# EAGLE design v2_board (EAGLE 9.1.0)
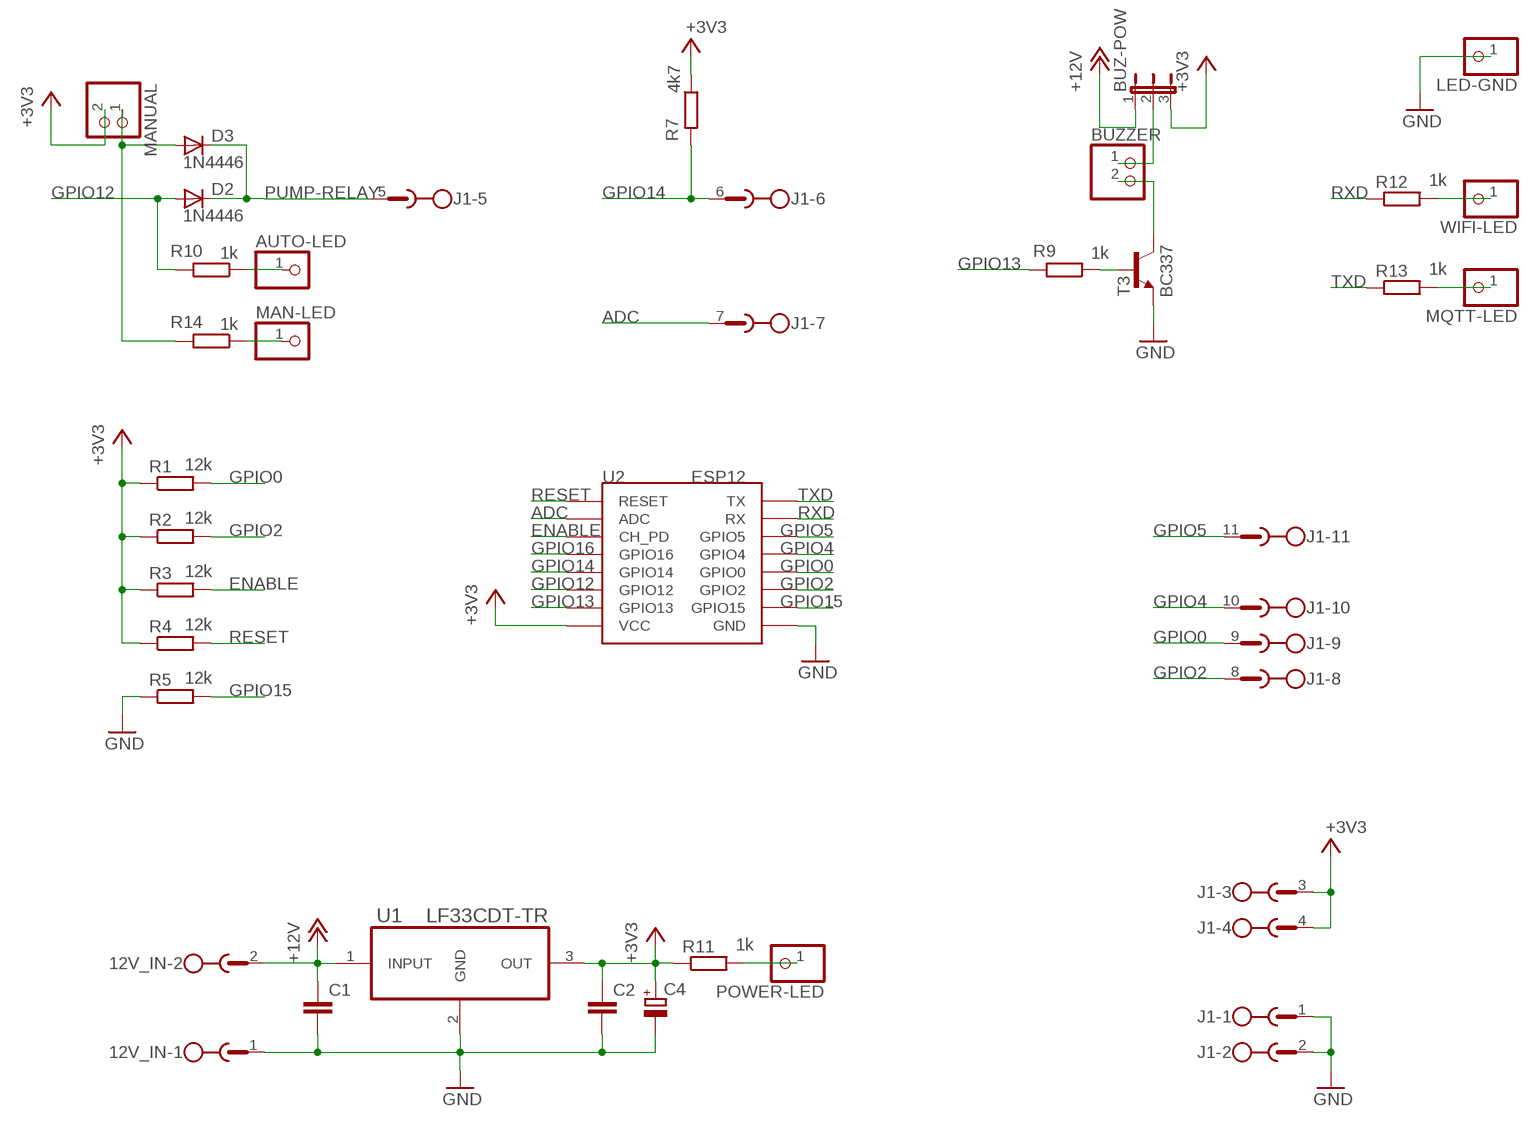
[diagram p0: schematic, sheet 1]

## Parts
12V_IN  MSTBA2  [MSTBA2]
AUTO-LED  PINHD-1X1  [1X01]
BUZ-POW  JP2E  [JP2]
BUZZER  PINHD-1X2  [1X02]
C1  C-EU025-025X050  [C025-025X050]
C2  C-EU025-025X050  [C025-025X050]
C4  CPOL-EUE3.5-8  [E3,5-8]
D2  1N4446  [DO35-10]
D3  1N4446  [DO35-10]
J1  MSTBA11  [MSTBA11]
LED-GND  PINHD-1X1  [1X01]
MAN-LED  PINHD-1X1  [1X01]
MANUAL  PINHD-1X2  [1X02]
MQTT-LED  PINHD-1X1  [1X01]
POWER-LED  PINHD-1X1  [1X01]
R1  12k  R-EU_R1206  [R1206]
R2  12k  R-EU_R1206  [R1206]
R3  12k  R-EU_R1206  [R1206]
R4  12k  R-EU_R1206  [R1206]
R5  12k  R-EU_R1206  [R1206]
R7  4k7  R-EU_R1206  [R1206]
R9  1k  R-EU_R1206  [R1206]
R10  1k  R-EU_R1206  [R1206]
R11  1k  R-EU_R1206  [R1206]
R12  1k  R-EU_R1206  [R1206]
R13  1k  R-EU_R1206  [R1206]
R14  1k  R-EU_R1206  [R1206]
T3  BC337  [TO92]
U1  LF33CDT-TR  [TO228P972X240-3N]
U2  ESP12  [ESP12]
WIFI-LED  PINHD-1X1  [1X01]

## Nets
+3V3: BUZ-POW.3 C2.1 C4.+ J1.3 J1.4 MANUAL.2 R1.1 R2.1 R3.1 R4.1 R7.1 R11.1 U1.3(OUT) U2.VCC
+12V: 12V_IN.2 BUZ-POW.1 C1.1 U1.1(INPUT)
ADC: J1.7 U2.ADC
ENABLE: R3.2 U2.CH_PD
GND: 12V_IN.1 C1.2 C2.2 C4.- J1.1 J1.2 LED-GND.1 R5.1 T3.1(E) U1.2(GND) U2.GND
GPIO0: J1.9 R1.2 U2.GPIO0
GPIO2: J1.8 R2.2 U2.GPIO2
GPIO4: J1.10 U2.GPIO5(GPIO4)
GPIO5: J1.11 U2.GPIO4(GPIO5)
GPIO12: D2.A R10.2 U2.GPIO12
GPIO13: R9.2 U2.GPIO13
GPIO14: J1.6 R7.2 U2.GPIO14
GPIO15: R5.2 U2.GPIO15
GPIO16: U2.GPIO16
N$5: D3.A MANUAL.1 R14.2
N$7: BUZZER.2 T3.3(C)
N$8: R9.1 T3.2(B)
N$9: BUZ-POW.2 BUZZER.1
N$11: POWER-LED.1 R11.2
N$12: R12.2 WIFI-LED.1
N$13: MQTT-LED.1 R13.2
N$16: AUTO-LED.1 R10.1
N$17: MAN-LED.1 R14.1
PUMP-RELAY: D2.C D3.C J1.5
RESET: R4.2 U2.RESET
RXD: R12.1 U2.RX
TXD: R13.1 U2.TX

## Library data of the parts
12V_IN = con-phoenix-508:MSTBA2: PHOENIX; MF: FARNELL; MPN: 1757242; OC_FARNELL: 3705171; OC_NEWARK: 71C4161
AUTO-LED LED-GND MAN-LED MQTT-LED POWER-LED WIFI-LED = pinhead:PINHD-1X1: PIN HEADER
BUZ-POW = jumper:JP2E: JUMPER
BUZZER MANUAL = pinhead:PINHD-1X2: PIN HEADER
C1 C2 = rcl:C-EU: CAPACITOR, European symbol; SPICEPREFIX: C
C4 = rcl:CPOL-EU: POLARIZED CAPACITOR, European symbol; SPICEPREFIX: C
D2 D3 = diode:1N4446: DIODE high speed (Philips)
J1 = con-phoenix-508:MSTBA11: PHOENIX; OC_FARNELL: unknown; OC_NEWARK: unknown
R1-R5 R7 R9-R14 = rcl:R-EU_: RESISTOR, European symbol; SPICEPREFIX: R
T3 = transistor:BC337: NPN TRANSISTOR
U1 = LF33CDT-TR:LF33CDT-TR: LDO, 0.45VDO, 1A, 3.3V, 1%, 3TO252; AVAILABILITY: Unavailable; DESCRIPTION: LFXX Series 500 mA 3.3 V Fixed VLDO Voltage Regulator with Inhibit - TO-252; MF: STMicroelectronics; MP: LF33CDT-TR; PACKAGE: TO-252-3 STMicroelectronics; PRICE: None
U2 = esp826612q:ESP12; SPICEPREFIX: X

## Board
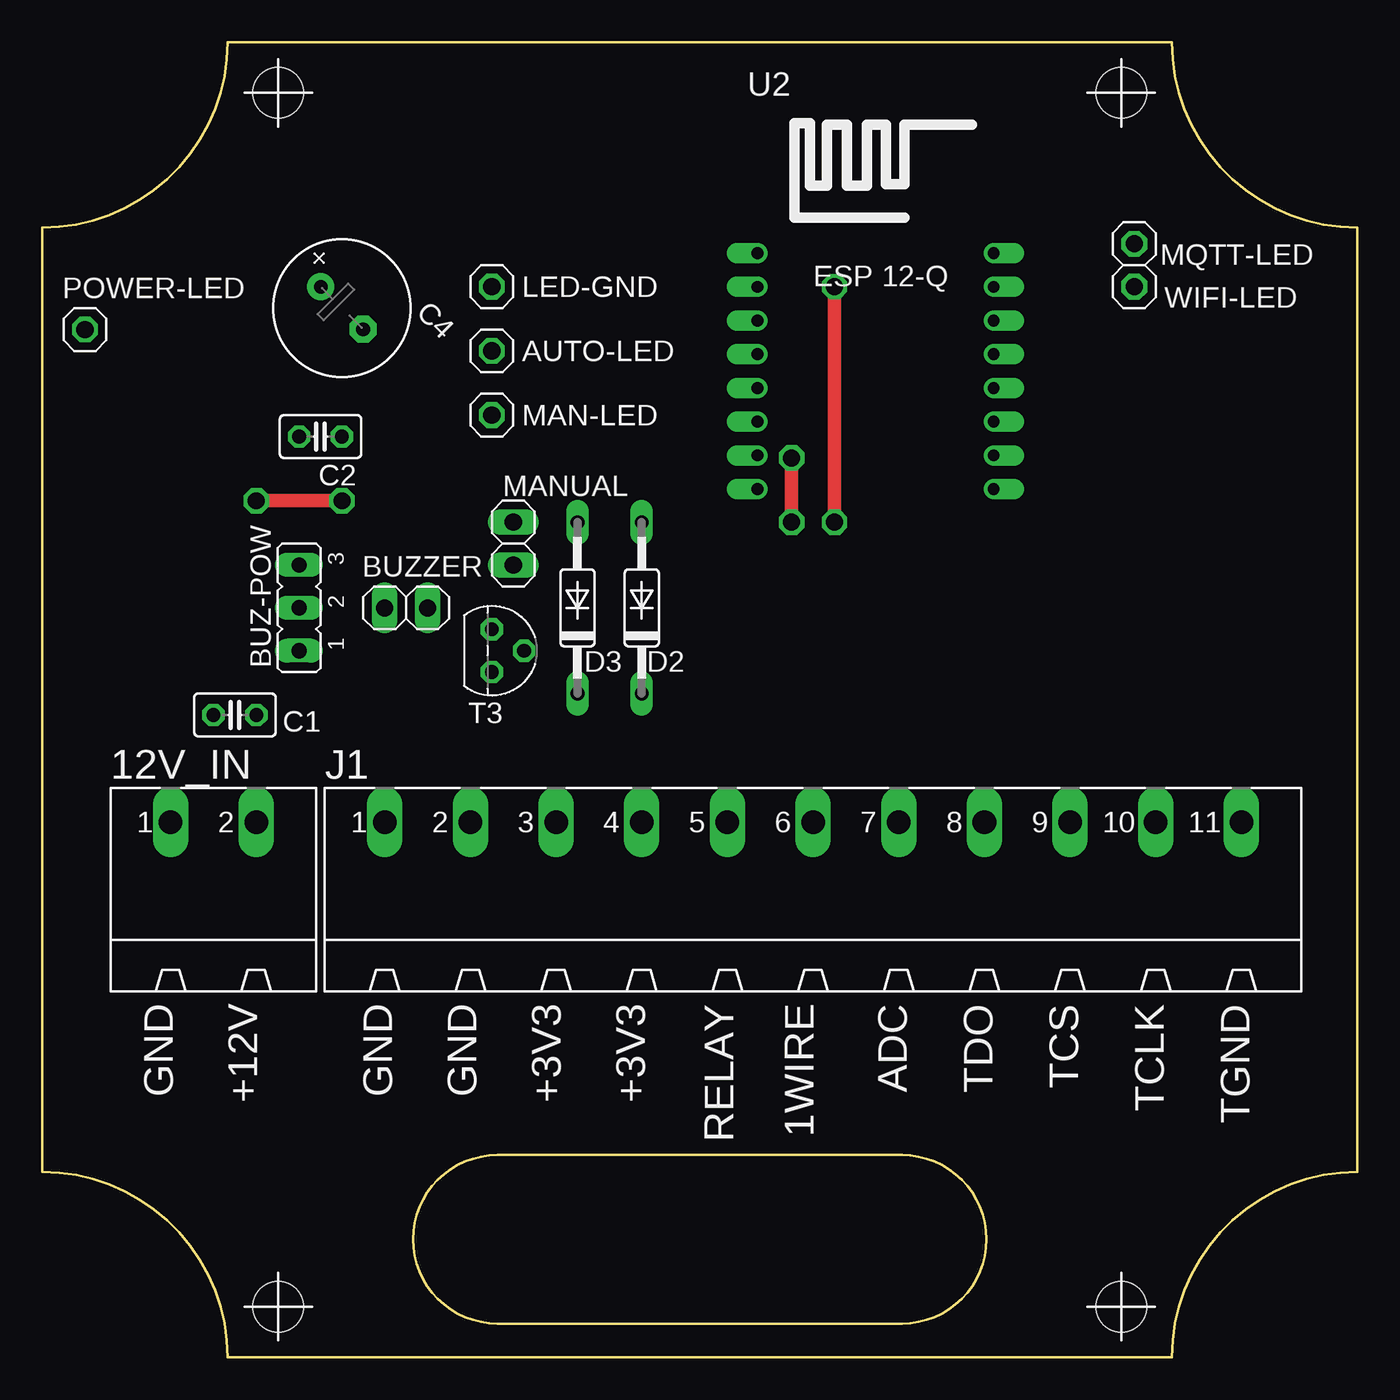
[diagram p1: board, top side]
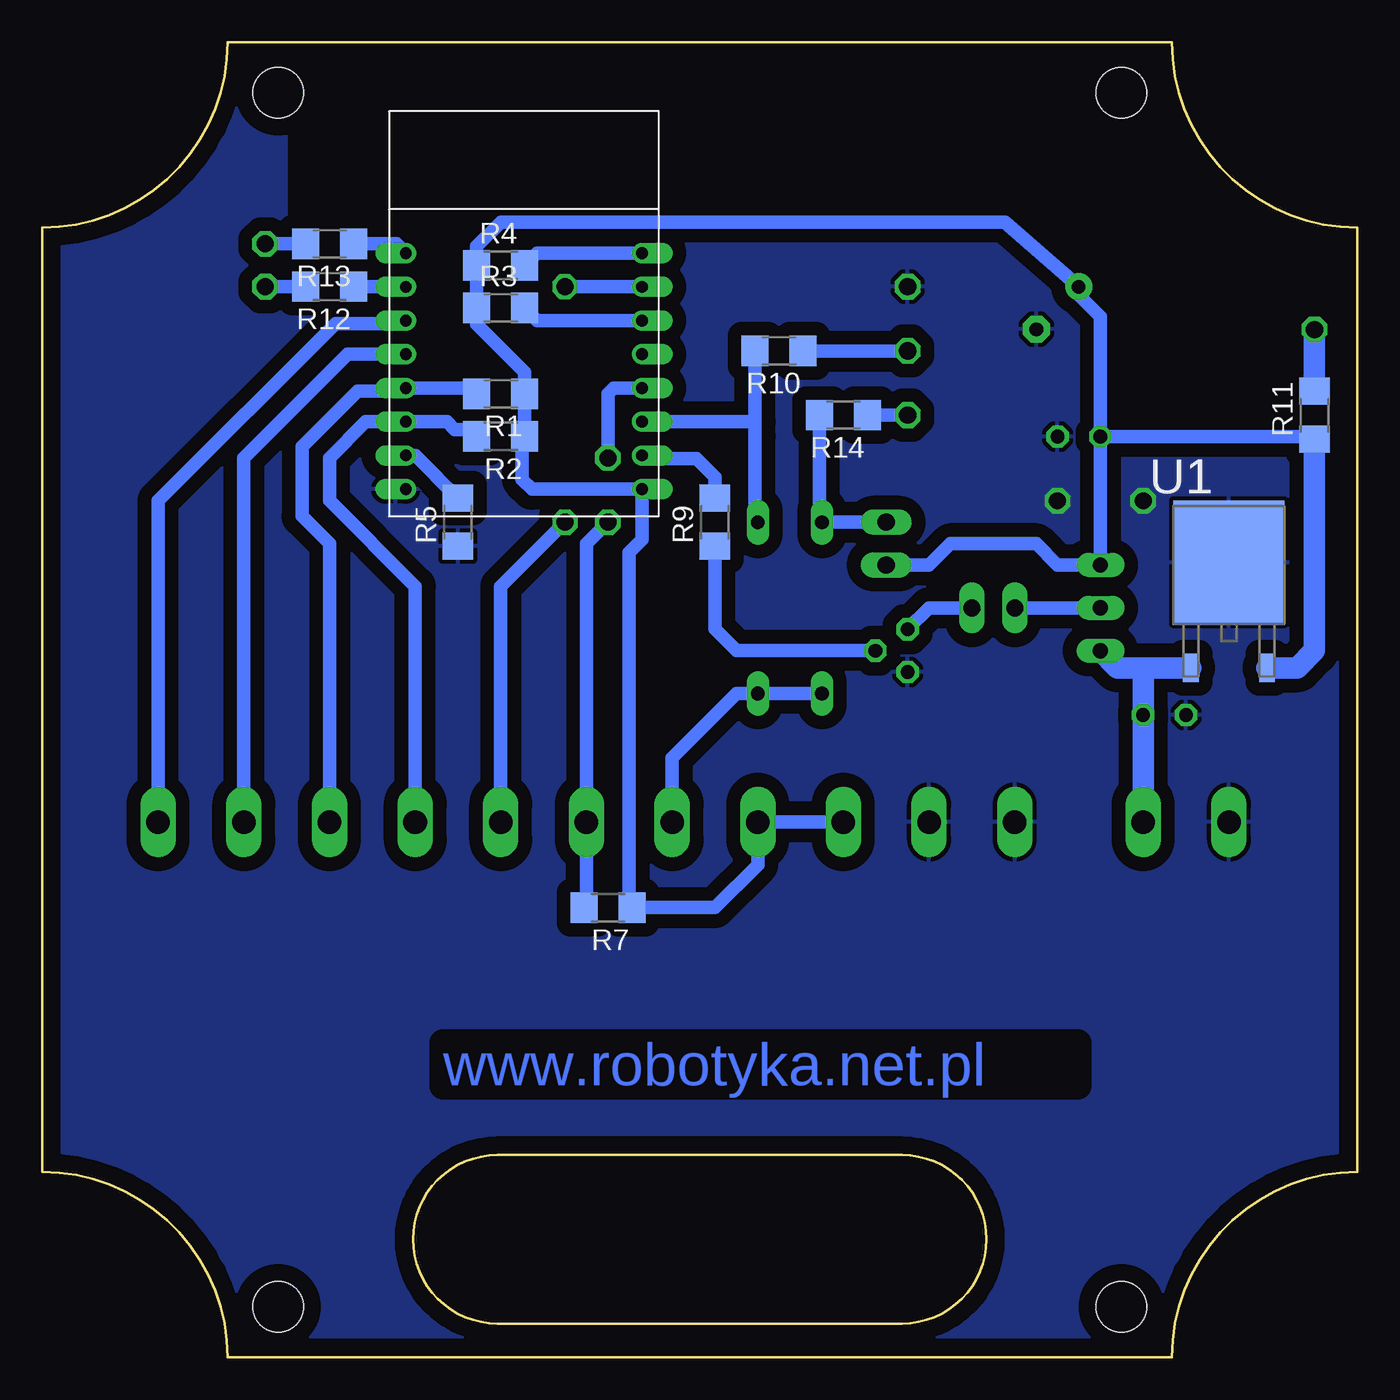
[diagram p2: board, bottom side, seen from below]

Size 78 x 78 mm. Coordinates in mm from the lower left corner, seen from the top.
Outline: 11,0 67,0 arc-90 78,11 78,67 arc-90 67,78 34,78 11,78 arc-90 0,67 0,11 arc-90 11,0
Outline: 27,2 arc-180 27,12 51,12 arc-180 51,2 27,2
Copper layers (1*16): Top 0.035mm / dielectric 1.5mm / Bottom 0.035mm
Design rules "default *": minimum track width 6mil, minimum drill 0.35mm, track to track 32mil, track to pad 32mil, pad to pad 6mil, via to via 6mil, smd to smd 6mil, copper to edge 40mil, drill to drill 6mil, minimum pad ring 10mil, minimum via ring 8mil, stop-mask expansion 4mil, vias tented up to drill 0mil, thermal gap 10mil
Holes 3 mm at 14,3 64,3 64,75 14,75

### Footprints (pad centres in the part's own frame; a part is rotated, then mirrored left to right if it is on the bottom)
MSTBA2 = drill 1.397 long: 1 -2.54,5.08; 2 2.54,5.08
1X01 = drill 1.016 octagon: 1 0,0
JP2 = drill 0.914 long: 1 -2.54,0; 2 0,0; 3 2.54,0
1X02 = drill 1.016 long: 1 -1.27,0; 2 1.27,0
C025-025X050 = drill 0.813 octagon: 1 -1.27,0; 2 1.27,0
E3,5-8 = drill 0.813 pad 1.6: + -1.778,0 | drill 0.813 pad 1.6 octagon: - 1.778,0
DO35-10 = drill 0.813 long: A 5.08,0; C -5.08,0
MSTBA11 = drill 1.397 long: 1 -25.4,5.08; 2 -20.32,5.08; 3 -15.24,5.08; 4 -10.16,5.08; 5 -5.08,5.08; 6 0,5.08; 7 5.08,5.08; 8 10.16,5.08; 9 15.24,5.08; 10 20.32,5.08; 11 25.4,5.08
R1206 = smd 1.6 x 1.803: 1 -1.422,0; 2 1.422,0
TO92 = drill 0.813 octagon: 1 1.27,0; 2 0,1.905; 3 -1.27,0
TO228P972X240-3N = smd 0.94 x 1.702: 1 -2.261,-6.096; 3 2.261,-6.096 | smd 6.604 x 7.315: 2 0,0.152
ESP12 = drill 0.7 offset: ADC -7.1,3.8; CH_PD -7.1,1.8; GND 6.9,-8.2; GPIO0 6.9,-2.2; GPIO2 6.9,-4.2; GPIO4 6.9,1.8; GPIO5 6.9,-0.2; GPIO12 -7.1,-4.2; GPIO13 -7.1,-6.2; GPIO14 -7.1,-2.2; GPIO15 6.9,-6.2; GPIO16 -7.1,-0.2; RESET -7.1,5.8; RX 6.9,3.8; TX 6.9,5.8; VCC -7.1,-8.2

### Placement (x,y rotation side)
12V_IN  10.16,26.67 0 top
AUTO-LED  26.67,59.69 0 top
BUZ-POW  15.24,44.45 90 top
BUZZER  21.59,44.45 0 top
C1  11.43,38.1 180 top
C2  16.51,54.61 0 top
C4  17.78,62.23 315 top
D2  35.56,44.45 90 top
D3  31.75,44.45 90 top
J1  45.72,26.67 0 top
LED-GND  26.67,63.5 0 top
MAN-LED  26.67,55.88 0 top
MANUAL  27.94,48.26 270 top
MQTT-LED  64.77,66.04 0 top
POWER-LED  2.54,60.96 0 top
R1  50.8,57.15 180 bottom
R2  50.8,54.61 180 bottom
R3  50.8,62.23 0 bottom
R4  50.8,64.77 0 bottom
R5  53.34,49.53 90 bottom
R7  44.45,26.67 180 bottom
R9  38.1,49.53 90 bottom
R10  34.29,59.69 180 bottom
R11  2.54,55.88 90 bottom
R12  60.96,63.5 180 bottom
R13  60.96,66.04 180 bottom
R14  30.48,55.88 180 bottom
T3  26.67,41.91 270 top
U1  7.62,46.99 0 bottom
U2  49.53,59.69 0 top
WIFI-LED  64.77,63.5 0 top

### Tracks (layer width: path | path; a pad name or v marks a point on that pad's centre or on a via)
+3V3
  Bottom 0.813: MANUAL.2 25.4,46.99 24.13,48.26 19.05,48.26 17.78,46.99 BUZ-POW.3 C2.1 | R11.1 2.69,54.61 C2.1 | C2.1 15.24,61.72 16.52,63 C4.+ 20.9,67.31 40.46,67.31 40.47,67.31 50.8,67.31 52.22,65.89 R4.1 R3.1 52.22,61.26 49.38,58.42 R1.1 R2.1 49.53,54.46 49.53,52.07 48.95,51.49 U2.VCC 42.43,48.49 43.18,47.74 43.18,26.82 R7.1 38.1,26.67 35.56,29.21 J1.4 J1.3
  Bottom 1.27: U1.3 3.56,40.89 2.54,41.91 R11.1
+12V
  Bottom 1.27: U1.1 12.7,40.89 | 12.7,40.89 14.22,40.89 BUZ-POW.1 | 12V_IN.2 C1.1 12.7,40.89
ADC  (via drill 1)
  Top 0.813: v46.99,63.5 v46.99,49.53
  Bottom 0.813: U2.ADC v46.99,63.5 | v46.99,49.53 50.8,45.72 J1.7
ENABLE
  Bottom 0.813: R3.2 48.64,61.49 U2.CH_PD
GND  (via drill 1)
  Top 0.813: v17.78,50.8 v12.7,50.8
  pour Bottom: 0,0 78.74,0 78.74,66.04 67.31,77.47 63.5,77.47 63.5,67.31 41.91,67.31 41.91,77.47 10.16,77.47 0,67.31
GPIO0
  Bottom 0.813: R1.2 52.56,57.49 U2.GPIO0 56.61,57.31 59.29,57.31 62.59,54.01 62.59,49.89 60.96,48.26 J1.9
GPIO2
  Bottom 0.813: R2.2 52.64,55.03 53.53,55.03 53.99,55.49 U2.GPIO2 58.81,55.49 60.96,53.34 60.96,50.8 55.88,45.72 J1.8
GPIO4
  Bottom 0.813: J1.10 66.04,53.34 59.89,59.49 U2.GPIO5
GPIO5
  Bottom 0.813: J1.11 71.12,50.8 60.61,61.31 56.61,61.31 U2.GPIO4
GPIO12
  Bottom 0.813: D2.A 35.71,49.68 35.71,54.61 35.71,55.49 | 35.71,55.49 R10.2 | U2.GPIO12 35.71,55.49
GPIO13
  Bottom 0.813: U2.GPIO13 42.25,53.31 39.2,53.31 38.1,52.22 R9.2
GPIO14  (via drill 1)
  Top 0.813: v44.45,53.34 v44.45,49.53
  Bottom 0.813: U2.GPIO14 44.11,57.49 44.45,57.15 v44.45,53.34 | R7.2 45.72,26.82 J1.6 45.72,48.26 v44.45,49.53
GPIO15
  Bottom 0.813: R5.2 54.61,52.22 54.61,52.24 55.85,53.49 U2.GPIO15
N$5
  Bottom 0.813: R14.2 31.9,49.68 D3.A MANUAL.1
N$7
  Bottom 0.813: BUZZER.2 25.4,44.45 T3.3
N$8
  Bottom 0.813: T3.2 36.83,41.91 38.1,43.18 R9.1 38.1,48.26
N$9
  Bottom 0.813: BUZ-POW.2 BUZZER.1
N$11
  Bottom 1.27: POWER-LED.1 R11.2
N$12
  Bottom 0.813: WIFI-LED.1 R12.2
N$13
  Bottom 0.813: R13.2 MQTT-LED.1
N$16
  Bottom 0.813: R10.1 AUTO-LED.1
N$17
  Bottom 0.813: R14.1 MAN-LED.1
PUMP-RELAY
  Bottom 0.813: D3.C D2.C 36.83,39.37 40.64,35.56 J1.5
RESET
  Bottom 0.813: R4.2 48.66,65.49 U2.RESET
RXD
  Bottom 0.813: U2.RX 59.53,63.49 R12.1
TXD
  Bottom 0.813: R13.1 56.98,66.04 U2.TX

### Text on the board
Bottom: www.robotyka.net.pl
tPlace: GND | +12V | GND | GND | +3V3 | +3V3 | RELAY | 1WIRE | ADC | TDO | TCS | TCLK | TGND